# EAGLE schematic Flash_Fashion Schematic (EAGLE 7.7.0)
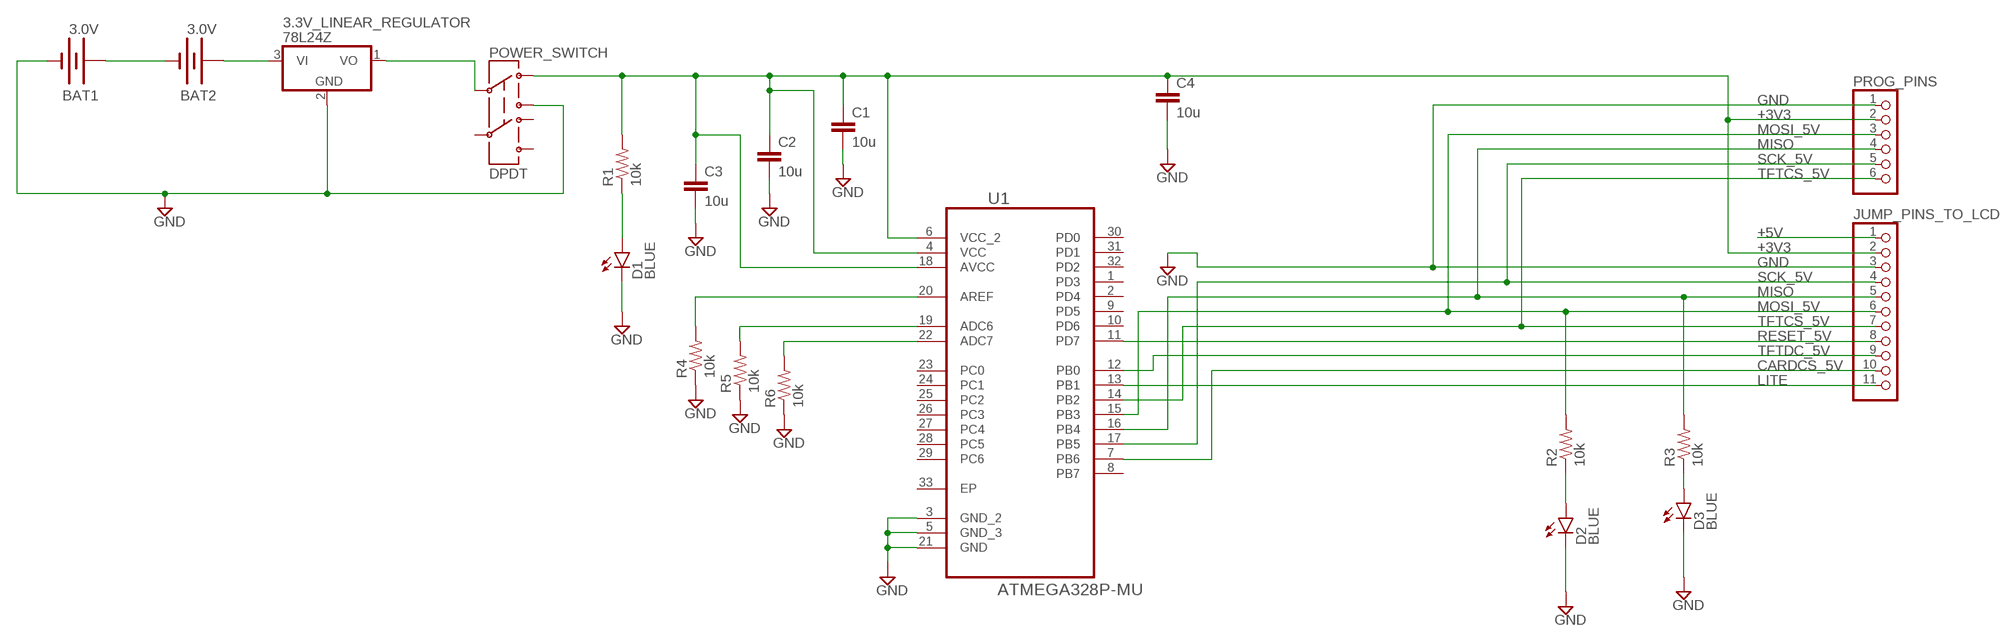
[diagram p0: schematic, sheet 1]

## Parts
3.3V_LINEAR_REGULATOR  78L24Z  [TO92]
BAT1  3.0V  BATTERY245PTH  [BATTCON_245MM_PTH]
BAT2  3.0V  BATTERY245PTH  [BATTCON_245MM_PTH]
C1  10u  CAP1206  [1206]
C2  10u  CAP1206  [1206]
C3  10u  CAP1206  [1206]
C4  10u  CAP1206  [1206]
D1  BLUE  LED-BLUE1206  [LED-1206]
D2  BLUE  LED-BLUE1206  [LED-1206]
D3  BLUE  LED-BLUE1206  [LED-1206]
JUMP_PINS_TO_LCD  HEADER-1X1176MIL  [1X11_ROUND_76]
POWER_SWITCH  DPDT  SWITCH-DPDTAYZ0202  [AYZ0202]
PROG_PINS  PINHD-1X6-3.5MM  [1X06-3.5MM]
R1  10k  RESISTOR1206  [1206]
R2  10k  RESISTOR1206  [1206]
R3  10k  RESISTOR1206  [1206]
R4  10k  RESISTOR1206  [1206]
R5  10k  RESISTOR1206  [1206]
R6  10k  RESISTOR1206  [1206]
U1  ATMEGA328P-MU  [QFN50P500X500X100-33N]

## Nets
+3V3 [power]: C1.1 C2.1 C3.1 C4.1 JUMP_PINS_TO_LCD.2 POWER_SWITCH.1 PROG_PINS.2 R1.2 U1.4(VCC) U1.6(VCC_2) U1.18(AVCC)
+5V [power]: JUMP_PINS_TO_LCD.1
CARDCS_5V: JUMP_PINS_TO_LCD.10 U1.7(PB6)
GND: 3.3V_LINEAR_REGULATOR.2(GND) BAT1.2(-) C1.2 C2.2 C3.2 C4.2 D1.C D2.C D3.C JUMP_PINS_TO_LCD.3 POWER_SWITCH.3 PROG_PINS.1 R4.1 R5.1 R6.1 U1.3(GND_2) U1.5(GND_3) U1.21(GND)
LITE: JUMP_PINS_TO_LCD.11 U1.13(PB1)
MISO: JUMP_PINS_TO_LCD.5 PROG_PINS.4 R3.2 U1.16(PB4)
MOSI_5V: JUMP_PINS_TO_LCD.6 PROG_PINS.3 R2.2 U1.15(PB3)
N$1: BAT1.3(+) BAT2.2(-)
N$2: 3.3V_LINEAR_REGULATOR.3(VI) BAT2.3(+)
N$3: D1.A R1.1
N$5: R4.2 U1.20(AREF)
N$7: 3.3V_LINEAR_REGULATOR.1(VO) POWER_SWITCH.2
N$8: D2.A R2.1
N$9: D3.A R3.1
N$10: R5.2 U1.19(ADC6)
N$11: R6.2 U1.22(ADC7)
RESET_5V: JUMP_PINS_TO_LCD.8 U1.11(PD7)
SCK_5V: JUMP_PINS_TO_LCD.4 PROG_PINS.5 U1.17(PB5)
TFTCS_5V: JUMP_PINS_TO_LCD.7 PROG_PINS.6 U1.14(PB2)
TFTDC_5V: JUMP_PINS_TO_LCD.9 U1.12(PB0)
Unconnected: POWER_SWITCH.4 POWER_SWITCH.5 POWER_SWITCH.6 U1.1(PD3) U1.2(PD4) U1.8(PB7) U1.9(PD5) U1.10(PD6) U1.23(PC0) U1.24(PC1) U1.25(PC2) U1.26(PC3) U1.27(PC4) U1.28(PC5) U1.29(PC6) U1.30(PD0) U1.31(PD1) U1.32(PD2) U1.33(EP)

## Library data of the parts
3.3V_LINEAR_REGULATOR = adafruit:78*: Positive VOLTAGE REGULATOR Added bigger pads to the TO-92 package
BAT1 BAT2 = SparkFun-Electromechanical:BATTERY: Battery Holders Various common sizes : AA, AAA, 18650 (PRT-12895), 20mm coin cell and 12mm coin cell. 20MM_4LEGS, BATT-10373
C1-C4 = SparkFun-Capacitors:CAP: Capacitor Standard 0603 ceramic capacitor, and 0.1" leaded capacitor.
D1-D3 = SparkFun-LED:LED-BLUE: Blue LEDs for production use Various blue LEDs stocked by SparkFun production 0603 - DIO-08575 Rebel - DIO-09553 1206 - DIO-09911; PROD_ID: DIO-09911
JUMP_PINS_TO_LCD = microbuilder:HEADER-1X11
POWER_SWITCH = SparkFun-Electromechanical:SWITCH-DPDT: DPDT Version of the COM-00597; PROD_ID: SWCH-08179
PROG_PINS = adafruit:PINHD-1X6: PIN HEADER
R1-R6 = SparkFun-Resistors:RESISTOR: Resistor Basic schematic elements and footprints for 0603, 1206, and PTH resistors.
U1 = Atmel_By_element14_Batch_1-00:ATMEGA328P-MU: Programmable Flash; MPN: ATMEGA328P-MU; OC_FARNELL: 1748522; OC_NEWARK: 26R2526; PACKAGE: QFN-32; SUPPLIER: Atmel

## Net classes
1 power: width 0.406 mm